# Altium schematic sheet 04_USB_UART_Service.SchDoc: USB_UART_Service
size A4; DrawnBy: YILDIRIM_DOGRU
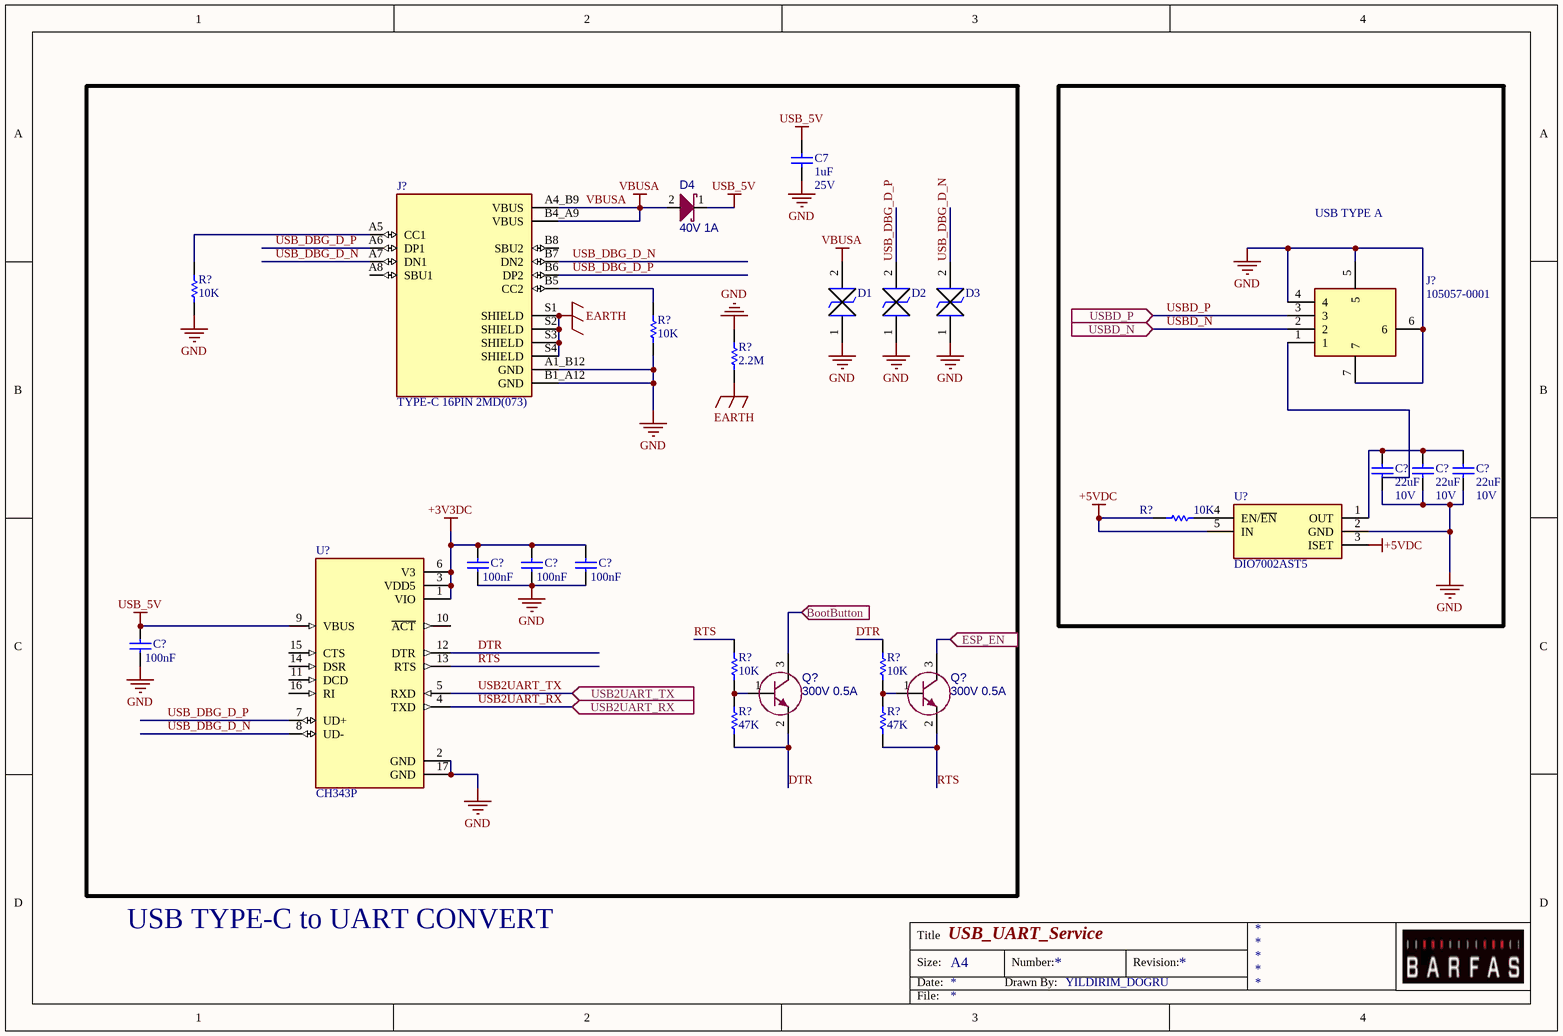
[diagram p0: 04_USB_UART_Service.SchDoc]

## Parts
(Parts that share a designator on the sheet are numbered #1, #2 ... from top to bottom, then left to right.)
C7  value 1uF  Voltage: 25V  [CAP_0603]  (hidden comment: CL10A105KA8NNNC)
C?#1  value 22uF  Voltage: 10V  [CAP_0805]  (hidden comment: CL21A226MPCLRNC)
C?#2  value 22uF  Voltage: 10V  [CAP_0805]  (hidden comment: CL21A226MPCLRNC)
C?#3  value 22uF  Voltage: 10V  [CAP_0805]  (hidden comment: CL21A226MPCLRNC)
C?#4  value 100nF  [CAP_0603]  (hidden comment: CL10B104KB8NNNL)
C?#5  value 100nF  [CAP_0603]  (hidden comment: CL10B104KB8NNNL)
C?#6  value 100nF  [CAP_0603]  (hidden comment: CL10B104KB8NNNL)
C?#7  value 100nF  [CAP_0603]  (hidden comment: CL10B104KB8NNNL)
D1  ATV02W5V0B-HF  [SODFL3718X130N]  (value not drawn)
D2  ATV02W5V0B-HF  [SODFL3718X130N]  (value not drawn)
D3  ATV02W5V0B-HF  [SODFL3718X130N]  (value not drawn)
D4  value 40V 1A  [SOD-123]  (hidden comment: PMEG4010EGWJ)
J?#1  TYPE-C 16PIN 2MD(073)  [HRO_TYPE-C-31-M-12]
J?#2  105057-0001  [1050570001]
Q?#1  value 300V 0.5A  [SOT-23-3]  (hidden comment: MMBTA42_R1_00001)
Q?#2  value 300V 0.5A  [SOT-23-3]  (hidden comment: MMBTA42_R1_00001)
R?#1  value 10K  [RES_0402]  (hidden comment: RC0402JR-0710KL)
R?#2  value 10K  [RES_0402]  (hidden comment: RC0402JR-0710KL)
R?#3  value 2.2M  [RES_0805]  (hidden comment: RES)
R?#4  value 10K  [RES_0402]  (hidden comment: RC0402JR-0710KL)
R?#5  value 10K  [RES_0402]  (hidden comment: RC0402JR-0710KL)
R?#6  value 10K  [RES_0402]  (hidden comment: RC0402JR-0710KL)
R?#7  value 47K  [RES_0603]  (hidden comment: 0603SAF4702T5E)
R?#8  value 47K  [RES_0603]  (hidden comment: 0603SAF4702T5E)
U?#1  DIO7002AST5  [SOT95P280X125-5N]
U?#2  CH343P  [QFN50P300X300X80-17N]

## Blocks framed on the sheet
USB TYPE A: C?#1-C?#3 J?#2 R?#4 U?#1

## Ports
BootButton (in), ESP_EN (in), USB2UART_RX (in), USB2UART_TX (in), USBD_N (in), USBD_P (in)

## Nets
+3V3DC: C?#4.2 C?#5.2 C?#6.2 U?#2.1(VIO) U?#2.3(VDD5) U?#2.6(V3)
+5VDC: R?#4.2 U?#1.3(ISET) U?#1.5(IN)
EARTH: J?#1.S1(SHIELD) J?#1.S2(SHIELD) J?#1.S3(SHIELD) J?#1.S4(SHIELD) R?#3.1
GND: C7.2 C?#1.2 C?#2.2 C?#3.2 C?#4.1 C?#5.1 C?#6.1 C?#7.1 D1.1 D2.1 D3.1 J?#1.A1_B12(GND) J?#1.B1_A12(GND) J?#2.4 J?#2.5 J?#2.6 J?#2.7 R?#1.1 R?#2.1 R?#3.2 U?#1.2(GND) U?#2.2(GND) U?#2.17(GND)
USB_5V: C7.1 C?#7.2 D4.1 U?#2.9(VBUS)
VBUSA: D1.2 D4.2 J?#1.A4_B9(VBUS) J?#1.B4_A9(VBUS)
BootButton: Q?#1.3(C) ; port BootButton
DTR: Q?#1.2(E) R?#6.2 R?#7.1 U?#2.12(DTR)
ESP_EN: Q?#2.3(C) ; port ESP_EN
RTS: Q?#2.2(E) R?#5.2 R?#8.1 U?#2.13(RTS)
USB2UART_RX: U?#2.4(TXD) ; port USB2UART_RX
USB2UART_TX: U?#2.5(RXD) ; port USB2UART_TX
USB_DBG_D_N: D3.2 J?#1.A7(DN1) J?#1.B7(DN2) U?#2.8(UD-)
USB_DBG_D_P: D2.2 J?#1.A6(DP1) J?#1.B6(DP2) U?#2.7(UD+)
USBD_N: J?#2.2 ; port USBD_N
USBD_P: J?#2.3 ; port USBD_P
NetC?#1_1: C?#1.1 C?#2.1 C?#3.1 U?#1.1(OUT)
NetJ?#1_A5: J?#1.A5(CC1) R?#1.2
NetJ?#1_B5: J?#1.B5(CC2) R?#2.2
NetQ?#1_1: Q?#1.1(B) R?#5.1 R?#7.2
NetQ?#2_1: Q?#2.1(B) R?#6.1 R?#8.2
NetR?#4_1: R?#4.1 U?#1.4(EN/~{EN})

Not connected (* = marked no-connect by the designer): J?#1 A8(SBU1) B8(SBU2); J?#2 1; U?#2 10(~{ACT}) 11(DCD) 14(DSR) 15(CTS) 16(RI)

## Notes on the sheet
- USB TYPE-C to UART CONVERT
- Title
- Size:
- Date:
- A4
- Drawn By:
- Number:
- Revision:
- File:

## Library data of the parts
C7 = C01757: CAP CER 1UF 25VDC %10 X5R SMD; Manufacturer: Samsung; Manufacturer Part Number: CL10A105KA8NNNC
C?#1-C?#3 = C01758: MLCC (2012) 0805 22uF 10VDC ±20% X5R; Manufacturer: Samsung; Manufacturer Part Number: CL21A226MPCLRNC
C?#4-C?#7 = CL10B104KB8NNNL: MLCC (1608) 0603 100nF 50VDC ±10% X7R; Manufacturer: Samsung Electro-Mechanics America, Inc; Supplier 1: OZDISAN; Manufacturer Part Number: CL10B104KB8NNNL
D1-D3 = ATV02W5V0B-HF: TVS Diode (Bi-directional); Manufacturer: Comchip Technology; Manufacturer Part Number: ATV02W5V0B-HF
D4 = PMEG4010EGWJ: DIODE SCHOTTKY 40V 1A SOD123; Manufacturer: Nexperia USA Inc.; Manufacturer Part Number: PMEG4010EGWJ
J?#1 = TYPE-C-31-M-12: CONN RCPT Type-C 16POS SMD R/A; Manufacturer: SHOU HAN; Value: *; Manufacturer Part Number: TYPE-C 16PIN 2MD(073)
J?#2 = 105057-0001: CONN RCPT USB2.0 TYPEA 4POS VERT; Manufacturer: Molex; Manufacturer Part Number: 105057-0001
Q?#1 Q?#2 = MMBTA42_R1_00001: TRANSISTOR DIS.500mA 300V NPN SOT23 GEN. SMT; Manufacturer: PANJIT; Package: SOT23; Supplier Part Number 1: 3757-MMBTA42_R1_00001CT-ND; Supplier Part Number 2: *; Supplier Part Number 3: MMBTA42_R1_00001; Supplier 1: DIGIKEY; Supplier 2: MOUSER; Supplier 3: OZDISAN; Manufacturer Part Number: MMBTA42_R1_00001
R?#1 R?#2 R?#4-R?#6 = R03000: RES.(1005) 0402 10K Ohms 5% 1/16W 100PPM SMT; Manufacturer: YAGEO; Manufacturer Part Number: RC0402JR-0710KL
R?#3 = R01913: RES SMD 2.2M OHM 1% 1/8W 0805; Manufacturer: Yageo; Manufacturer Part Number: RC0805FR-072M2L
R?#7 R?#8 = 0603SAF4702T5E: RES.(1608) 0603 47K Ohms 1% 1/10W-S 100PPM; Manufacturer: ROYALOHM; Supplier 1: Ozdisan; Manufacturer Part Number: 0603SAF4702T5E
U?#1 = DIO7002AST5: Low Loss Power Distribution Switch; Manufacturer: DIOO Microcircuits; Manufacturer Part Number: DIO7002AST5
U?#2 = CH343P: USB to High-Speed Serial Chip CH343; Manufacturer: WCH; SnapEDA_Link: https://www.snapeda.com/parts/CH343P/WCH/view-part/?ref=snap; Package: Package; Value: *; Manufacturer Part Number: CH343P; Check_prices: https://www.snapeda.com/parts/CH343P/WCH/view-part/?ref=eda